# Altium schematic sheet STM32 NHÓM 18 L01.SchDoc: STM32F103C8T6
size 304 x 241 mm; ApprovedBy: L01; CheckedBy: NHOM 18; Author: NHOM 18; CompanyName: NHOM 18; DrawnBy: NHOM 18; Engineer: NHOM 18; Organization: NHOM 18; SheetNumber: 0329947569; Time: 10/2/2024
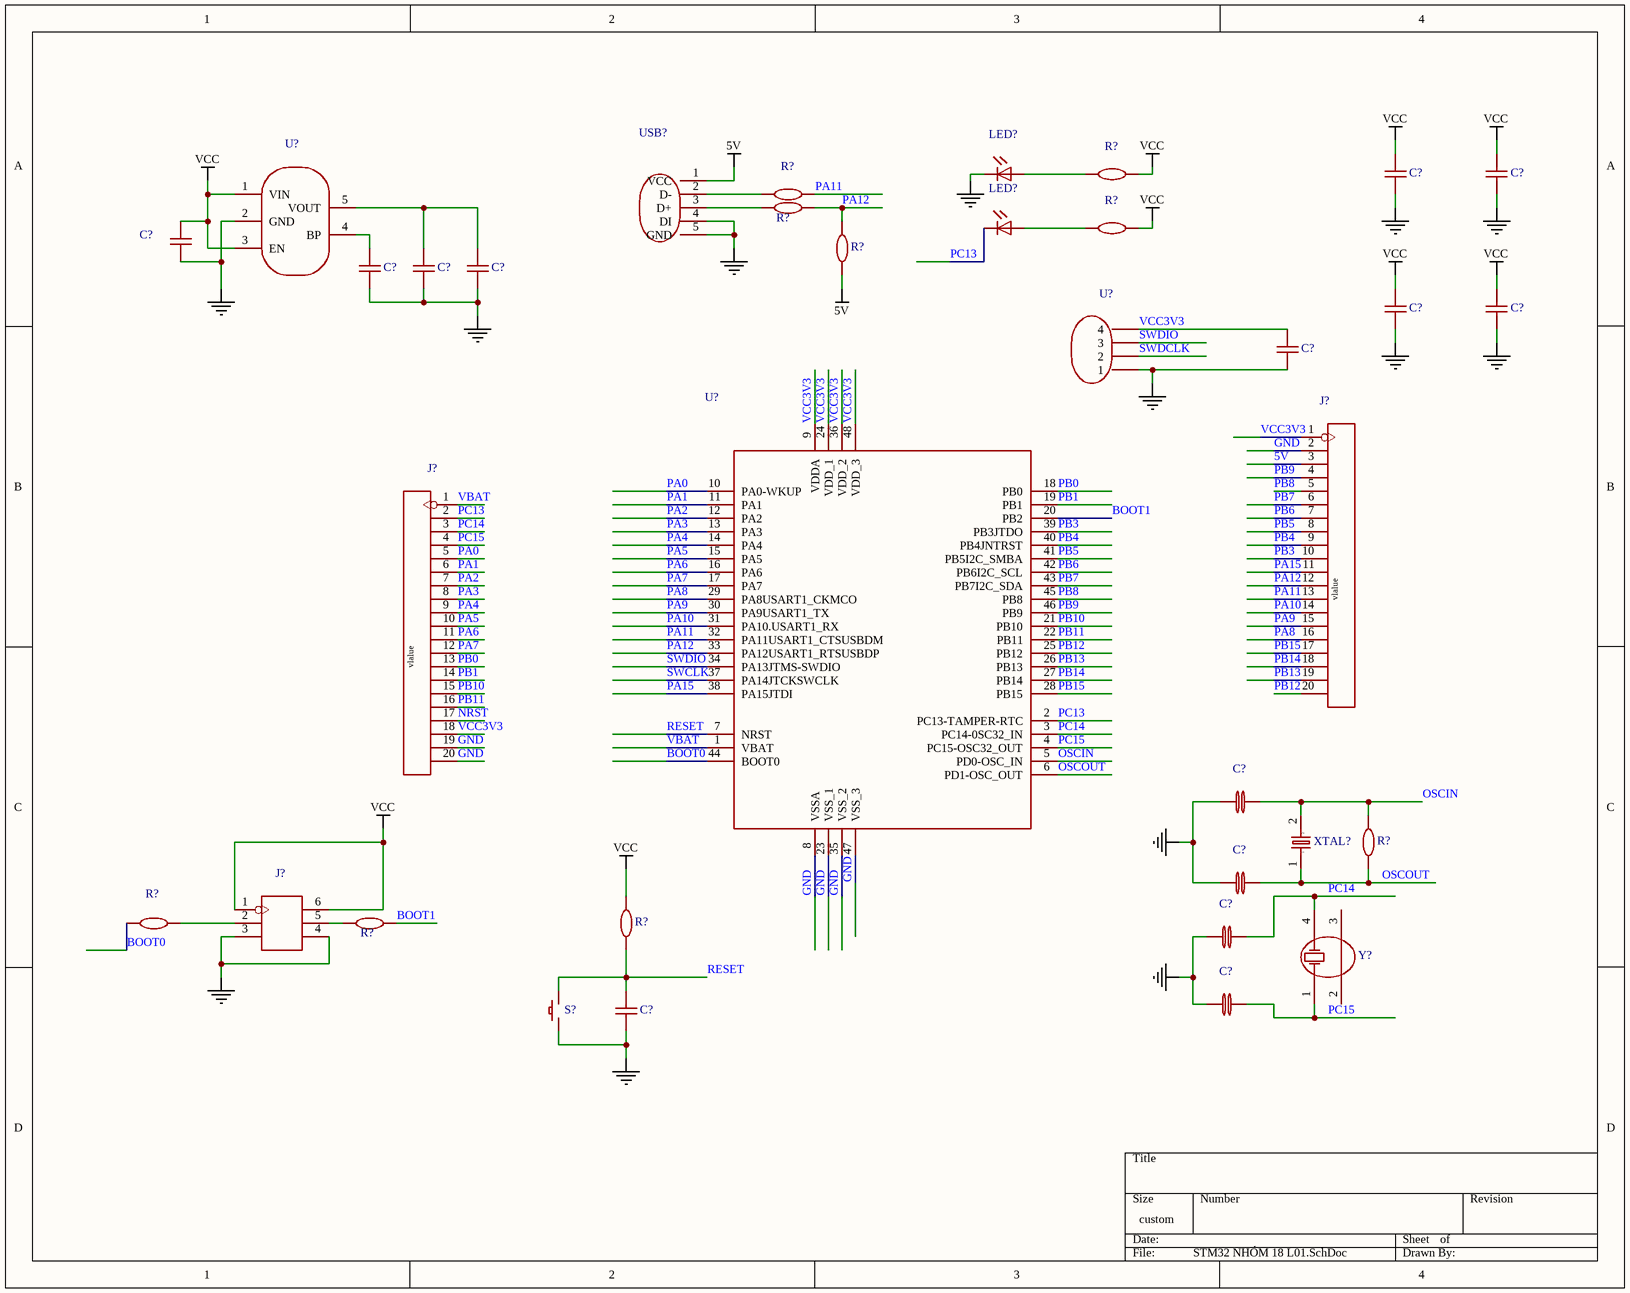
[diagram p0: STM32 NHÓM 18 L01.SchDoc]

## Parts
(Parts that share a designator on the sheet are numbered #1, #2 ... from top to bottom, then left to right.)
C?#1  100nF  (value not drawn)
C?#2  100nF  (value not drawn)
C?#3  105  (value not drawn)
C?#4  223  (value not drawn)
C?#5  106  (value not drawn)
C?#6  104  (value not drawn)
C?#7  100nF  (value not drawn)
C?#8  100nF  (value not drawn)
C?#9  100nF  (value not drawn)
C?#10  CAP  (value not drawn)
C?#11  CAP  (value not drawn)
C?#12  CAP  (value not drawn)
C?#13  CAP  (value not drawn)
C?#14  105  (value not drawn)
J?#1  HEADER-20P-2.54  (value not drawn)
J?#2  HEADER-20P-2.54  (value not drawn)
J?#3  F185-1203A1BSYA1  (value not drawn)
LED?#1  LEDCHIPLED_0805  (value not drawn)
LED?#2  LEDCHIPLED_0805  (value not drawn)
R?#1  510Ω  (value not drawn)
R?#2  20R  (value not drawn)
R?#3  20R  (value not drawn)
R?#4  510Ω  (value not drawn)
R?#5  4.7K  (value not drawn)
R?#6  1M  (value not drawn)
R?#7  100K  (value not drawn)
R?#8  100K  (value not drawn)
R?#9  10K  (value not drawn)
S?  2P-SW-SMD  (value not drawn)
U?#1  RT9193-33GB  (value not drawn)
U?#2  header4  (value not drawn)
U?#3  IC_UC_STM32  (value not drawn)
USB?  USB-Micro-1  (value not drawn)
XTAL?  8M  (value not drawn)
Y?  RSM200S32.768  (value not drawn)

## Nets
5V: J?#1.3(P$3) R?#5.1 USB?.1(VCC)
GND: C?#1.1 C?#2.1 C?#3.2 C?#4.1 C?#5.1 C?#6.1 C?#7.1 C?#8.1 C?#9.1 C?#10.1 C?#11.1 C?#12.1 C?#13.1 C?#14.1 J?#1.2(P$2) J?#2.19(P$19) J?#2.20(P$20) J?#3.3 J?#3.4 LED?#1.C S?.2 U?#1.2(GND) U?#2.1 U?#3.8(VSSA) U?#3.23(VSS_1) U?#3.35(VSS_2) U?#3.47(VSS_3) USB?.4(DI) USB?.5(GND)
VCC: C?#1.2 C?#2.2 C?#3.1 C?#7.2 C?#8.2 J?#3.1 J?#3.6 R?#1.2 R?#4.2 R?#9.2 U?#1.1(VIN) U?#1.3(EN)
BOOT0: R?#7.2 U?#3.44(BOOT0)
BOOT1: R?#8.1 U?#3.20(PB2)
NRST: J?#2.17(P$17)
OSCIN: C?#10.2 R?#6.2 U?#3.5(PD0-OSC_IN) XTAL?.2
OSCOUT: C?#11.2 R?#6.1 U?#3.6(PD1-OSC_OUT) XTAL?.1
PA0: J?#2.5(P$5) U?#3.10(PA0-WKUP)
PA1: J?#2.6(P$6) U?#3.11(PA1)
PA2: J?#2.7(P$7) U?#3.12(PA2)
PA3: J?#2.8(P$8) U?#3.13(PA3)
PA4: J?#2.9(P$9) U?#3.14(PA4)
PA5: J?#2.10(P$10) U?#3.15(PA5)
PA6: J?#2.11(P$11) U?#3.16(PA6)
PA7: J?#2.12(P$12) U?#3.17(PA7)
PA8: J?#1.16(P$16) U?#3.29(PA8USART1_CKMCO)
PA9: J?#1.15(P$15) U?#3.30(PA9USART1_TX)
PA10: J?#1.14(P$14) U?#3.31(PA10.USART1_RX)
PA11: J?#1.13(P$13) R?#2.2 U?#3.32(PA11USART1_CTSUSBDM)
PA12: J?#1.12(P$12) R?#3.2 R?#5.2 U?#3.33(PA12USART1_RTSUSBDP)
PA15: J?#1.11(P$11) U?#3.38(PA15JTDI)
PB0: J?#2.13(P$13) U?#3.18(PB0)
PB1: J?#2.14(P$14) U?#3.19(PB1)
PB3: J?#1.10(P$10) U?#3.39(PB3JTDO)
PB4: J?#1.9(P$9) U?#3.40(PB4JNTRST)
PB5: J?#1.8(P$8) U?#3.41(PB5I2C_SMBA)
PB6: J?#1.7(P$7) U?#3.42(PB6I2C_SCL)
PB7: J?#1.6(P$6) U?#3.43(PB7I2C_SDA)
PB8: J?#1.5(P$5) U?#3.45(PB8)
PB9: J?#1.4(P$4) U?#3.46(PB9)
PB10: J?#2.15(P$15) U?#3.21(PB10)
PB11: J?#2.16(P$16) U?#3.22(PB11)
PB12: J?#1.20(P$20) U?#3.25(PB12)
PB13: J?#1.19(P$19) U?#3.26(PB13)
PB14: J?#1.18(P$18) U?#3.27(PB14)
PB15: J?#1.17(P$17) U?#3.28(PB15)
PC13: J?#2.2(P$2) LED?#2.C U?#3.2(PC13-TAMPER-RTC)
PC14: C?#12.2 J?#2.3(P$3) U?#3.3(PC14-0SC32_IN) Y?.4(OSC2)
PC15: C?#13.2 J?#2.4(P$4) U?#3.4(PC15-OSC32_OUT) Y?.1(OSC1)
RESET: C?#14.2 R?#9.1 S?.3 U?#3.7(NRST)
SWCLK: U?#3.37(PA14JTCKSWCLK)
SWDCLK: U?#2.2
SWDIO: U?#2.3 U?#3.34(PA13JTMS-SWDIO)
VBAT: J?#2.1(P$1) U?#3.1(VBAT)
VCC3V3: C?#9.2 J?#1.1(P$1) J?#2.18(P$18) U?#2.4 U?#3.9(VDDA) U?#3.24(VDD_1) U?#3.36(VDD_2) U?#3.48(VDD_3)
NetC?#4_2: C?#4.2 U?#1.4(BP)
NetC?#5_2: C?#5.2 C?#6.2 U?#1.5(VOUT)
NetJ?#3_2: J?#3.2 R?#7.1
NetJ?#3_5: J?#3.5 R?#8.2
NetLED?#1_A: LED?#1.A R?#1.1
NetLED?#2_A: LED?#2.A R?#4.1
NetR?#2_1: R?#2.1 USB?.2(D-)
NetR?#3_1: R?#3.1 USB?.3(D+)

Not connected (* = marked no-connect by the designer): Y? 2(COM) 3(COM)

## Notes on the sheet
- (in symbol HEADER-20P-2.54) vlalue

## Library data of the parts
C?#1 C?#2 C?#7-C?#9 = 100nF: Manufacturer: FH; Manufacturer Part: 0603B104K500NT; Voltage: 50V; Tolerance: ±10%; EasyEDA: E30926; Convert to PCB: yes; Origin Footprint: 0603; Symbol: 100nF; Device: 100nF; Value: 100nF; Supplier: EasyEDA; Add into BOM: yes
C?#3 = 105: Manufacturer: FH; Manufacturer Part: 0603B105K250NT; Value: 1uF; Voltage: 25V; Tolerance: ±10%; EasyEDA: E59302; Convert to PCB: yes; Origin Footprint: 0603; Symbol: 105; Device: 105; Supplier: EasyEDA; Add into BOM: yes
C?#4 = 223: Manufacturer: FH; Manufacturer Part: 0603B104K500NT; Value: 100nF; Voltage: 50V; Tolerance: ±10%; EasyEDA: E30926; Convert to PCB: yes; Origin Footprint: 0603; Symbol: 223; Device: 223; Supplier: EasyEDA; Add into BOM: yes
C?#5 = 106: Manufacturer: FH; Manufacturer Part: 0603B104K500NT; Value: 100nF; Voltage: 50V; Tolerance: ±10%; EasyEDA: E30926; Convert to PCB: yes; Origin Footprint: 0603; Symbol: 106; Device: 106; Supplier: EasyEDA; Add into BOM: yes
C?#6 = 104: Manufacturer: FH; Manufacturer Part: 0603B104K500NT; Value: 100nF; Voltage: 50V; Tolerance: ±10%; EasyEDA: E30926; Convert to PCB: yes; Origin Footprint: 0603; Symbol: 104; Device: 104; Supplier: EasyEDA; Add into BOM: yes
C?#10-C?#13 = CAP: Convert to PCB: yes; Origin Footprint: 0603-CAP; Symbol: CAP; Device: CAP; Manufacturer Part: ?; Add into BOM: yes
C?#14 = 105: Manufacturer: FH; Manufacturer Part: 0603B104K500NT; Value: 100nF; Voltage: 50V; Tolerance: ±10%; EasyEDA: E30926; Convert to PCB: yes; Origin Footprint: 0603; Symbol: 105; Device: 105; Supplier: EasyEDA; Add into BOM: yes
J?#1 J?#2 = HEADER-20P-2.54: Convert to PCB: yes; Origin Footprint: H20-2.54; Symbol: HEADER-20P-2.54; Device: HEADER-20P-2.54; Manufacturer Part: ?; Add into BOM: yes
J?#3 = F185-1203A1BSYA1: SeeedStudio: 320030011; Convert to PCB: yes; Origin Footprint: H2X3-2.54; Symbol: F185-1203A1BSYA1; Device: F185-1203A1BSYA1; Supplier: SeeedStudio; Manufacturer Part: F185-1203A1BSYA1; Add into BOM: yes
LED?#1 LED?#2 = LEDCHIPLED_0805: Convert to PCB: yes; Symbol: LEDCHIPLED_0805; Device: LEDCHIPLED_0805; Manufacturer Part: ?; Add into BOM: yes; Origin Footprint: CHIPLED_0805
R?#1 R?#4 = 510Ω: Manufacturer: UniOhm; Manufacturer Part: 0603WAF5100T5E; Power: 1/10W; Tolerance: ±1%; EasyEDA: E23193; Convert to PCB: yes; Origin Footprint: 0603; Symbol: 510Ω; Device: 510Ω; Value: 510Ω; Supplier: EasyEDA; Add into BOM: yes
R?#2 R?#3 = 20R: Manufacturer: UniOhm; Manufacturer Part: 0603WAF5100T5E; Power: 1/10W; Value: 510Ω; Tolerance: ±1%; EasyEDA: E23193; Convert to PCB: yes; Origin Footprint: 0603; Symbol: 20R; Device: 20R; Supplier: EasyEDA; Add into BOM: yes
R?#5 = 4.7K: Manufacturer: UniOhm; Manufacturer Part: 0603WAF5100T5E; Power: 1/10W; Value: 510Ω; Tolerance: ±1%; EasyEDA: E23193; Convert to PCB: yes; Origin Footprint: 0603; Symbol: 4.7K; Device: 4.7K; Supplier: EasyEDA; Add into BOM: yes
R?#6 = 1M: Manufacturer: UniOhm; Manufacturer Part: 0603WAF5100T5E; Power: 1/10W; Value: 510Ω; Tolerance: ±1%; EasyEDA: E23193; Convert to PCB: yes; Origin Footprint: 0603; Symbol: 1M; Device: 1M; Supplier: EasyEDA; Add into BOM: yes
R?#7 R?#8 = 100K: Manufacturer: UniOhm; Manufacturer Part: 0603WAF5100T5E; Power: 1/10W; Value: 510Ω; Tolerance: ±1%; EasyEDA: E23193; Convert to PCB: yes; Origin Footprint: 0603; Symbol: 100K; Device: 100K; Supplier: EasyEDA; Add into BOM: yes
R?#9 = 10K: Manufacturer: UniOhm; Manufacturer Part: 0603WAF5100T5E; Power: 1/10W; Value: 510Ω; Tolerance: ±1%; EasyEDA: E23193; Convert to PCB: yes; Origin Footprint: 0603; Symbol: 10K; Device: 10K; Supplier: EasyEDA; Add into BOM: yes
S? = 2P-SW-SMD: Convert to PCB: yes; Origin Footprint: 2PSW-SMD; Symbol: 2P-SW-SMD; Device: 2P-SW-SMD; Manufacturer Part: ?; Add into BOM: yes
U?#1 = RT9193-33GB: Manufacturer: RICHTEK; EasyEDA: E15651; Convert to PCB: yes; Origin Footprint: SOT-23-5; Symbol: RT9193-33GB; Device: RT9193-33GB; Supplier: EasyEDA; Manufacturer Part: RT9193-33GB; Add into BOM: yes
U?#2 = header4: Convert to PCB: yes; Origin Footprint: H4-2.54; Symbol: header4; Device: header4; Manufacturer Part: ?; Add into BOM: yes
U?#3 = IC_UC_STM32: Convert to PCB: yes; Origin Footprint: LQFP48; Symbol: IC_UC_STM32; Device: IC_UC_STM32; Manufacturer Part: ?; Add into BOM: yes
USB? = USB-Micro-1: Manufacturer: EasyEDA; EasyEDA: E40939; Convert to PCB: yes; Origin Footprint: MICROUSB; Symbol: USB-Micro-1; Device: USB-Micro-1; Supplier: EasyEDA; Manufacturer Part: USB-Micro-1; Add into BOM: yes
XTAL? = 8M: Convert to PCB: yes; Origin Footprint: HC-49U; Symbol: 8M; Device: 8M; Manufacturer Part: ?; Add into BOM: yes
Y? = RSM200S32.768: Convert to PCB: yes; Symbol: RSM200S32.768; Device: RSM200S32.768; Manufacturer Part: ?; Add into BOM: yes; Origin Footprint: RSM200S